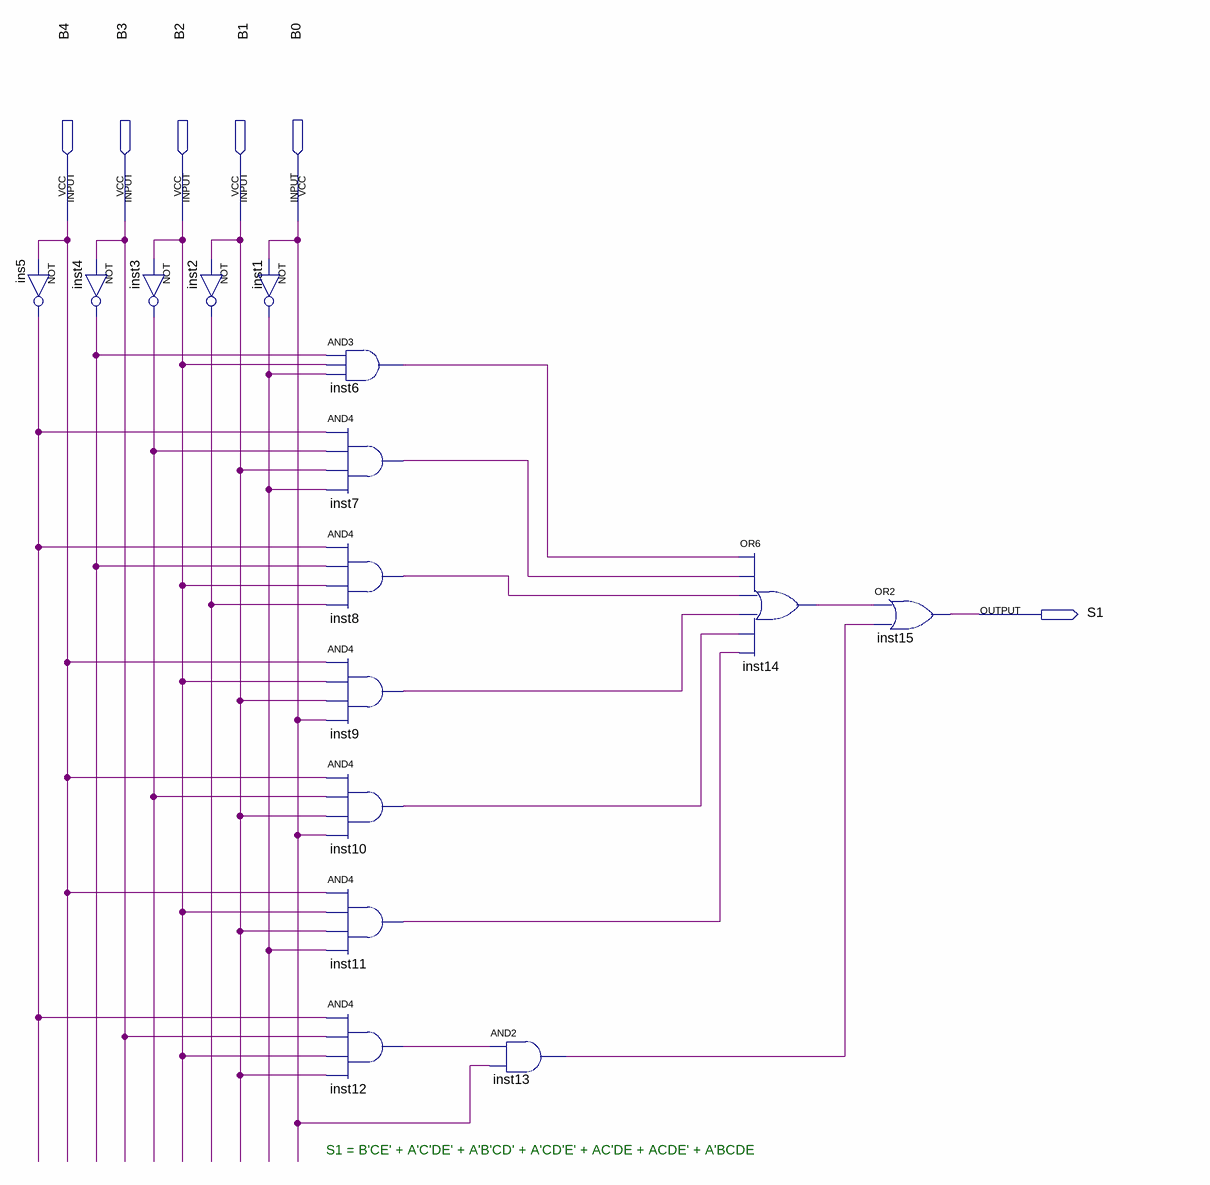
[diagram p0: schematic sheet]
// Quartus schematic Andares_Elevador_S1.bdf as structural Verilog: 15 symbols, 6 pins
module Andares_Elevador_S1 (
  input  B4,
  input  B3,
  input  B2,
  input  B1,
  input  B0,
  output S1
);

  wire ins5_out, inst1_out, inst2_out, inst3_out, inst4_out, inst6_out, inst7_out, inst8_out, inst9_out,
       inst10_out, inst11_out, inst12_out, inst13_out, inst14_out;

  not ins5 (ins5_out, B4);
  not inst3 (inst3_out, B2);
  not inst4 (inst4_out, B3);
  not inst2 (inst2_out, B1);
  not inst1 (inst1_out, B0);
  and inst6 (inst6_out, inst4_out, B2, inst1_out);
  and inst7 (inst7_out, ins5_out, inst3_out, B1, inst1_out);
  and inst8 (inst8_out, ins5_out, inst4_out, B2, inst2_out);
  and inst9 (inst9_out, B4, B2, B1, B0);
  and inst10 (inst10_out, B4, inst3_out, B1, B0);
  and inst11 (inst11_out, B4, B2, B1, inst1_out);
  and inst12 (inst12_out, ins5_out, B3, B2, B1);
  and inst13 (inst13_out, inst12_out, B0);
  or inst14 (inst14_out, inst6_out, inst7_out, inst8_out, inst9_out, inst10_out, inst11_out);
  or inst15 (S1, inst14_out, inst13_out);

  // Notes on the sheet:
  //   S1 = B'CE' + A'C'DE' + A'B'CD' + A'CD'E' + AC'DE + ACDE' + A'BCDE
endmodule
